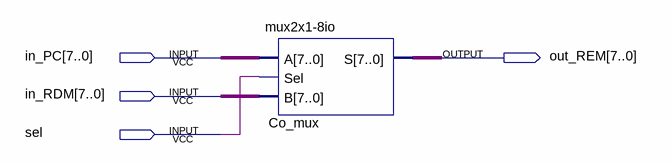
[diagram p0: schematic sheet]
// Quartus schematic mux.bdf as structural Verilog: 1 symbols, 4 pins
module mux (
  input  [7:0] in_PC,
  input  [7:0] in_RDM,
  input  sel,
  output [7:0] out_REM
);

  \mux2x1-8io  Co_mux (.A(in_PC), .Sel(sel), .B(in_RDM), .S(out_REM));
endmodule
